# Altium schematic sheet Net Names 2.SchDoc
size A4; SheetNumber: 4; SheetTotal: 4
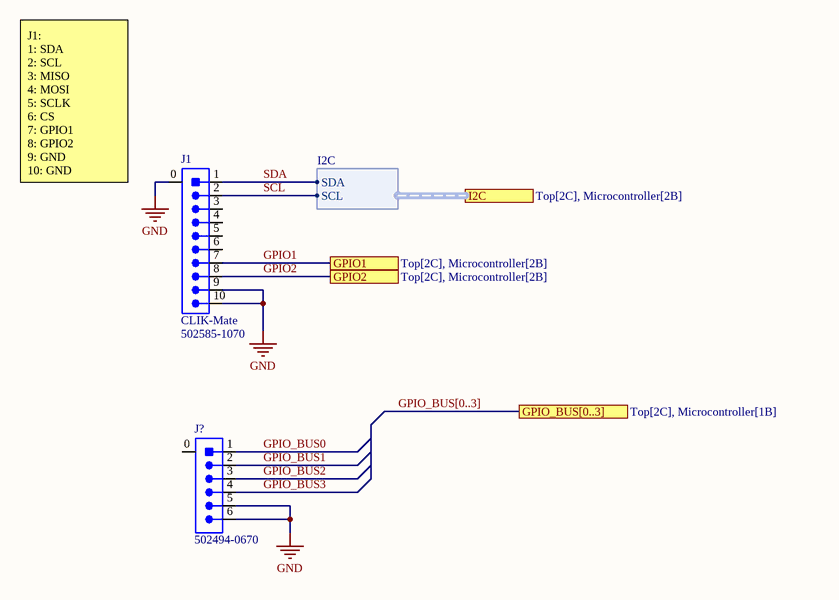
[diagram p0: Net Names 2.SchDoc]

## Parts
J1  Family: CLIK-Mate  Manufacturer Part Number 1: 502585-1070  [MOLEX-5025851070]  (hidden comment: CON_10M_SM_RA)
J?  Manufacturer Part Number 1: 502494-0670  [MOLEX-5024940670]  (hidden comment: CON_6M_SM_RA)

## Ports
GPIO1 (see Top[2C], Microcontroller[2B]), GPIO2 (see Top[2C], Microcontroller[2B]), GPIO_BUS[0..3] (see Top[2C], Microcontroller[1B]), I2C (harness I2C, see Top[2C], Microcontroller[2B])

## Harnesses
I2C: SDA, SCL

## Nets
GND: J1.0 J1.9 J1.10 J?.5 J?.6
GPIO1: J1.7 ; port GPIO1
GPIO2: J1.8 ; port GPIO2
GPIO_BUS0: J?.1
GPIO_BUS1: J?.2
GPIO_BUS2: J?.3
GPIO_BUS3: J?.4
SCL: J1.2 ; port I2C.SCL
SDA: J1.1 ; port I2C.SDA

Not connected (* = marked no-connect by the designer): J1 3 4 5 6; J? 0

## Buses and harness runs
bus GPIO_BUS[0..3] = port GPIO_BUS[0..3]

## Notes on the sheet
- J1:
  1: SDA
  2: SCL
  3: MISO
  4: MOSI
  5: SCLK
  6: CS
  7: GPIO1
  8: GPIO2
  9: GND
  10: GND

## Library data of the parts
J1 = CON_10M_SM_RA: CONN HEADER SMD RIGHT ANGLE 1.5 MM PITCH; Manufacturer 1: Molex; Current Rating: 2A; Voltage Rating: 100V; Pitch: 1.5mm; Supplier 1: Digi-Key; Supplier Part Number 1: WM14472CT-ND; Orientation: Right Angle
J? = CON_6M_SM_RA: CONN HEADER SMD RIGHT ANGLE 2MM PITCH; Manufacturer 1: Molex; Current Rating: 3A; Voltage Rating: 250V; Supplier 1: Digi-Key; Orientation: Right Angle; Pitch: 2mm; Supplier Part Number 1: WM2283CT-ND